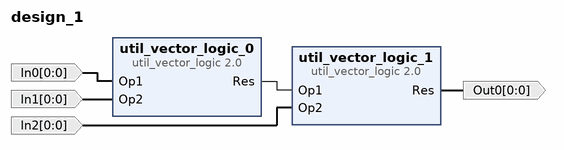
[diagram p0: block diagram of the top level]
# Vivado block design design_1, xc7z020clg484-1, Vivado 2019.1
create_bd_design design_1

create_bd_port -dir I -from 0 -to 0 In0
create_bd_port -dir I -from 0 -to 0 In1
create_bd_port -dir I -from 0 -to 0 In2
create_bd_port -dir O -from 0 -to 0 Out0

create_bd_cell -type ip -vlnv xilinx.com:ip:util_vector_logic:2.0 util_vector_logic_0
set_property -dict {CONFIG.C_OPERATION or CONFIG.C_SIZE 1} [get_bd_cells util_vector_logic_0]
create_bd_cell -type ip -vlnv xilinx.com:ip:util_vector_logic:2.0 util_vector_logic_1
set_property -dict {CONFIG.C_SIZE 1} [get_bd_cells util_vector_logic_1]

# ---- connections ----

connect_bd_net [get_bd_pins util_vector_logic_0/Res] [get_bd_pins util_vector_logic_1/Op1]
connect_bd_net -net Op1_0_1 [get_bd_ports In0] [get_bd_pins util_vector_logic_0/Op1]
connect_bd_net -net Op2_0_1 [get_bd_ports In1] [get_bd_pins util_vector_logic_0/Op2]
connect_bd_net -net Op2_1_1 [get_bd_ports In2] [get_bd_pins util_vector_logic_1/Op2]
connect_bd_net [get_bd_pins util_vector_logic_1/Res] [get_bd_ports Out0]

validate_bd_design
save_bd_design
